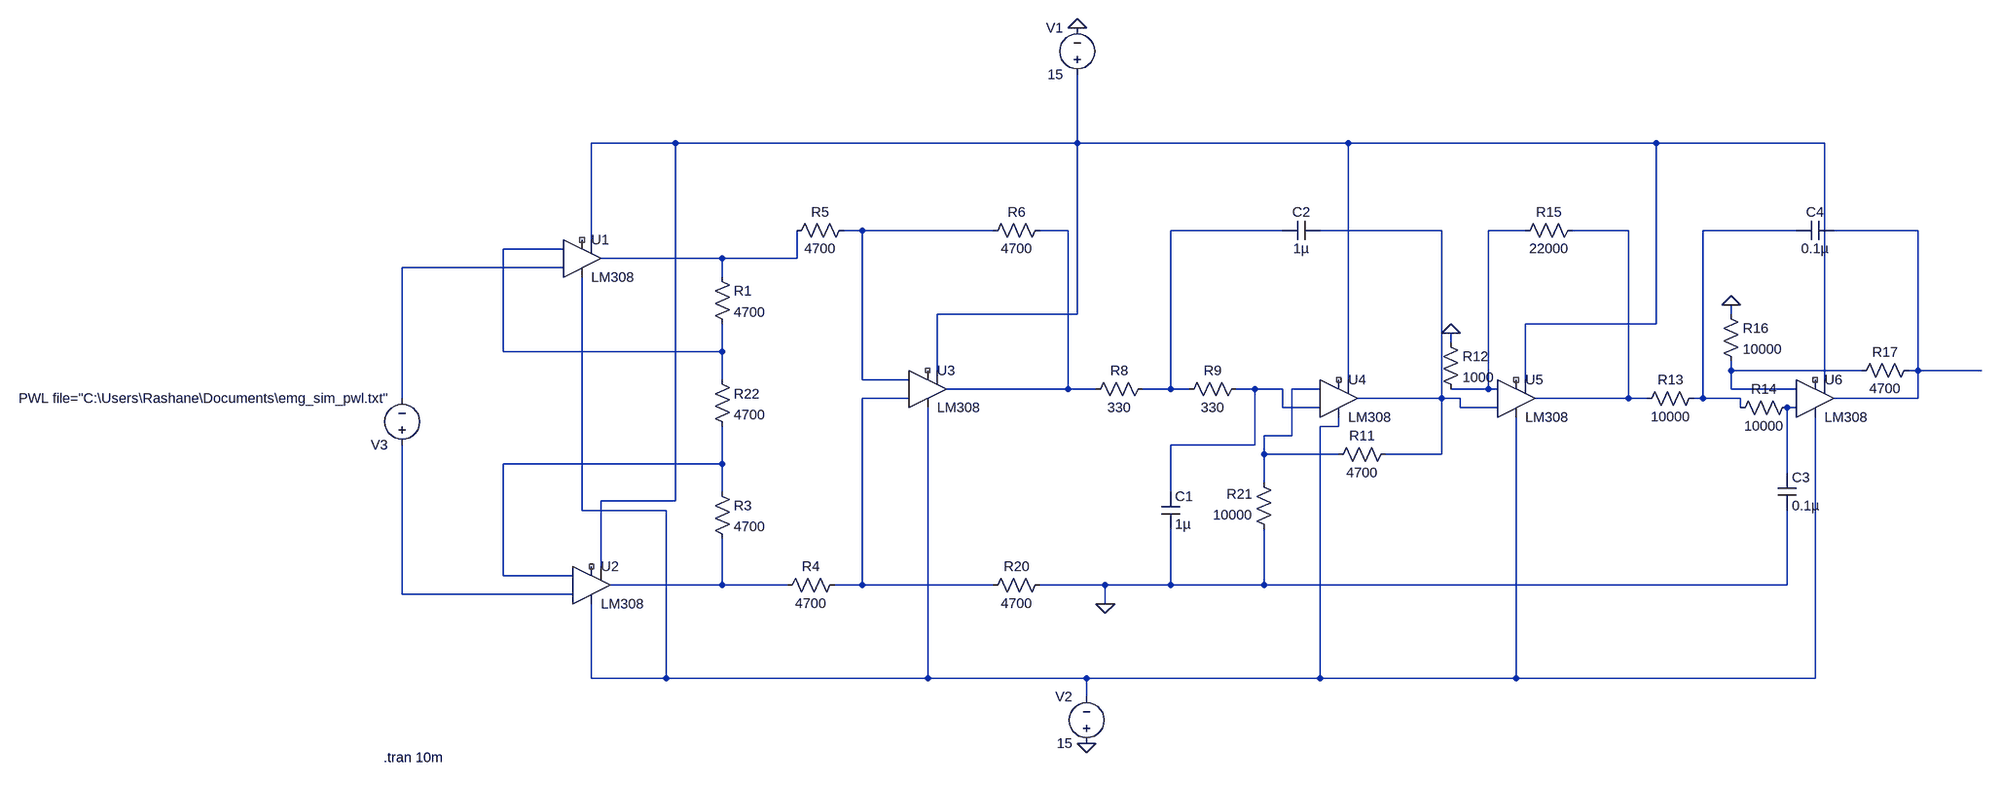
[diagram p0: schematic emg_simulate.asc]
emg_simulate.asc, the LTspice schematic file:
Version 4
SHEET 1 1876 1000
WIRE -432 -144 -576 -144
WIRE 256 -144 256 -320
WIRE 256 -144 -432 -144
WIRE 720 -144 256 -144
WIRE 1248 -144 720 -144
WIRE 1536 -144 1248 -144
WIRE -112 32 -144 32
WIRE 112 32 -112 32
WIRE 240 32 192 32
WIRE 608 32 416 32
WIRE 880 32 672 32
WIRE 1024 32 960 32
WIRE 1200 32 1104 32
WIRE 1488 32 1328 32
WIRE 1696 32 1552 32
WIRE -576 48 -576 -144
WIRE -624 64 -864 64
WIRE -352 80 -560 80
WIRE -224 80 -224 32
WIRE -224 80 -352 80
WIRE -624 96 -1072 96
WIRE -352 112 -352 80
WIRE 256 176 256 -144
WIRE 256 176 16 176
WIRE 1376 176 1376 160
WIRE 1248 192 1248 -144
WIRE 1248 192 1024 192
WIRE 896 224 896 208
WIRE -864 240 -864 64
WIRE -352 240 -352 192
WIRE -352 240 -864 240
WIRE 16 272 16 176
WIRE 1376 272 1376 256
WIRE 1600 272 1376 272
WIRE 1696 272 1696 32
WIRE 1696 272 1680 272
WIRE 1872 272 1696 272
WIRE -352 288 -352 240
WIRE -112 288 -112 32
WIRE -32 288 -112 288
WIRE 720 288 720 -144
WIRE 1024 288 1024 192
WIRE 1536 288 1536 -144
WIRE 240 304 240 32
WIRE 240 304 32 304
WIRE 288 304 240 304
WIRE 416 304 416 32
WIRE 416 304 368 304
WIRE 448 304 416 304
WIRE 560 304 528 304
WIRE 608 304 560 304
WIRE 672 304 624 304
WIRE 960 304 960 32
WIRE 960 304 896 304
WIRE 976 304 960 304
WIRE 1376 304 1376 272
WIRE 1488 304 1376 304
WIRE -1072 320 -1072 96
WIRE -32 320 -112 320
WIRE 880 320 880 32
WIRE 880 320 736 320
WIRE 912 320 880 320
WIRE 1200 320 1200 32
WIRE 1200 320 1040 320
WIRE 1232 320 1200 320
WIRE 1328 320 1328 32
WIRE 1328 320 1312 320
WIRE 1392 320 1328 320
WIRE 1696 320 1696 272
WIRE 1696 320 1552 320
WIRE 608 336 608 304
WIRE 672 336 608 336
WIRE 912 336 912 320
WIRE 976 336 912 336
WIRE 1392 336 1392 320
WIRE 1488 336 1472 336
WIRE 704 368 704 352
WIRE 704 368 672 368
WIRE 624 384 624 304
WIRE 624 384 576 384
WIRE 560 400 560 304
WIRE 560 400 416 400
WIRE 576 416 576 384
WIRE 704 416 576 416
WIRE 880 416 880 320
WIRE 880 416 784 416
WIRE -352 432 -352 368
WIRE -352 432 -864 432
WIRE 1472 448 1472 336
WIRE 576 464 576 416
WIRE -352 480 -352 432
WIRE 416 480 416 400
WIRE -432 496 -432 -144
WIRE -432 496 -560 496
WIRE -592 512 -592 112
WIRE -448 512 -592 512
WIRE -560 608 -560 496
WIRE -864 624 -864 432
WIRE -608 624 -864 624
WIRE -352 640 -352 560
WIRE -352 640 -544 640
WIRE -240 640 -352 640
WIRE -112 640 -112 320
WIRE -112 640 -160 640
WIRE 112 640 -112 640
WIRE 304 640 192 640
WIRE 416 640 416 544
WIRE 416 640 304 640
WIRE 576 640 576 544
WIRE 576 640 416 640
WIRE 1472 640 1472 512
WIRE 1472 640 576 640
WIRE -1072 656 -1072 400
WIRE -608 656 -1072 656
WIRE 304 672 304 640
WIRE -576 848 -576 672
WIRE -448 848 -448 512
WIRE -448 848 -576 848
WIRE 0 848 0 336
WIRE 0 848 -448 848
WIRE 272 848 0 848
WIRE 672 848 672 368
WIRE 672 848 272 848
WIRE 1008 848 1008 352
WIRE 1008 848 672 848
WIRE 1520 848 1520 352
WIRE 1520 848 1008 848
WIRE 272 880 272 848
FLAG 304 672 0
FLAG 896 208 0
FLAG 1376 160 0
FLAG 256 -400 0
FLAG 272 960 0
SYMBOL res -368 96 R0
SYMATTR InstName R1
SYMATTR Value 4700
SYMBOL res -368 272 R0
SYMATTR InstName R22
SYMATTR Value 4700
SYMBOL res -368 464 R0
SYMATTR InstName R3
SYMATTR Value 4700
SYMBOL res -144 624 R90
WINDOW 0 0 56 VBottom 2
WINDOW 3 32 56 VTop 2
SYMATTR InstName R4
SYMATTR Value 4700
SYMBOL res -128 16 R90
WINDOW 0 0 56 VBottom 2
WINDOW 3 32 56 VTop 2
SYMATTR InstName R5
SYMATTR Value 4700
SYMBOL res 208 16 R90
WINDOW 0 0 56 VBottom 2
WINDOW 3 32 56 VTop 2
SYMATTR InstName R6
SYMATTR Value 4700
SYMBOL res 208 624 R90
WINDOW 0 0 56 VBottom 2
WINDOW 3 32 56 VTop 2
SYMATTR InstName R20
SYMATTR Value 4700
SYMBOL res 384 288 R90
WINDOW 0 0 56 VBottom 2
WINDOW 3 32 56 VTop 2
SYMATTR InstName R8
SYMATTR Value 330
SYMBOL res 544 288 R90
WINDOW 0 0 56 VBottom 2
WINDOW 3 32 56 VTop 2
SYMATTR InstName R9
SYMATTR Value 330
SYMBOL res 592 560 R180
WINDOW 0 36 76 Left 2
WINDOW 3 36 40 Left 2
SYMATTR InstName R21
SYMATTR Value 10000
SYMBOL OpAmps\\LM308 -592 16 R0
SYMATTR InstName U1
SYMBOL OpAmps\\LM308 -576 576 R0
SYMATTR InstName U2
SYMBOL OpAmps\\LM308 0 240 R0
SYMATTR InstName U3
SYMBOL OpAmps\\LM308 704 256 R0
SYMATTR InstName U4
SYMBOL res 800 400 R90
WINDOW 0 0 56 VBottom 2
WINDOW 3 32 56 VTop 2
SYMATTR InstName R11
SYMATTR Value 4700
SYMBOL cap 400 480 R0
SYMATTR InstName C1
SYMATTR Value 1µ
SYMBOL cap 672 16 R90
WINDOW 0 0 32 VBottom 2
WINDOW 3 32 32 VTop 2
SYMATTR InstName C2
SYMATTR Value 1µ
SYMBOL OpAmps\\LM308 1008 256 R0
SYMATTR InstName U5
SYMBOL OpAmps\\LM308 1520 256 R0
SYMATTR InstName U6
SYMBOL res 880 208 R0
SYMATTR InstName R12
SYMATTR Value 1000
SYMBOL res 1328 304 R90
WINDOW 0 0 56 VBottom 2
WINDOW 3 32 56 VTop 2
SYMATTR InstName R13
SYMATTR Value 10000
SYMBOL res 1488 320 R90
WINDOW 0 0 56 VBottom 2
WINDOW 3 32 56 VTop 2
SYMATTR InstName R14
SYMATTR Value 10000
SYMBOL cap 1456 448 R0
SYMATTR InstName C3
SYMATTR Value 0.1µ
SYMBOL res 1120 16 R90
WINDOW 0 0 56 VBottom 2
WINDOW 3 32 56 VTop 2
SYMATTR InstName R15
SYMATTR Value 22000
SYMBOL res 1360 160 R0
SYMATTR InstName R16
SYMATTR Value 10000
SYMBOL res 1696 256 R90
WINDOW 0 0 56 VBottom 2
WINDOW 3 32 56 VTop 2
SYMATTR InstName R17
SYMATTR Value 4700
SYMBOL cap 1552 16 R90
WINDOW 0 0 32 VBottom 2
WINDOW 3 32 32 VTop 2
SYMATTR InstName C4
SYMATTR Value 0.1µ
SYMBOL voltage 256 -304 R180
WINDOW 0 24 96 Left 2
WINDOW 3 24 16 Left 2
WINDOW 123 0 0 Left 0
WINDOW 39 0 0 Left 0
SYMATTR InstName V1
SYMATTR Value 15
SYMBOL voltage 272 976 R180
WINDOW 0 24 96 Left 2
WINDOW 3 24 16 Left 2
WINDOW 123 0 0 Left 0
WINDOW 39 0 0 Left 0
SYMATTR InstName V2
SYMATTR Value 15
SYMBOL voltage -1072 416 R180
WINDOW 123 0 0 Left 0
WINDOW 39 0 0 Left 0
SYMATTR InstName V3
SYMATTR Value PWL file="C:\Users\Rashane\Documents\emg_sim_pwl.txt"
TEXT -1104 984 Left 2 !.tran 10m

The netlist it stands for:
* emg_simulate.asc
R1 N011 N010 4700
R22 N010 N019 4700
R3 N019 N020 4700
R4 N016 N020 4700
R5 N002 N011 4700
R6 N003 N002 4700
R20 0 N016 4700
R8 N004 N003 330
R9 N014 N004 330
R21 0 N015 10000
XU1 N012 N010 N001 N018 N011 NC_01 NC_02 LT1008
XU2 N021 N019 N001 N018 N020 NC_03 NC_04 LT1008
XU3 N016 N002 N001 N018 N003 NC_05 NC_06 LT1008
XU4 N014 N015 N001 N018 N005 NC_07 NC_08 LT1008
R11 N005 N015 4700
C1 N014 0 1µ
C2 N005 N004 1µ
XU5 N005 N006 N001 N018 N007 NC_09 NC_10 LT1008
XU6 N017 N013 N001 N018 N009 NC_11 NC_12 LT1008
R12 0 N006 1000
R13 N008 N007 10000
R14 N017 N008 10000
C3 N017 0 0.1µ
R15 N007 N006 22000
R16 0 N013 10000
R17 N009 N013 4700
C4 N009 N008 0.1µ
V1 N001 0 15
V2 0 N018 15
V3 N021 N012 PWL file="C:\Users\Rashane\Documents\emg_sim_pwl.txt"
.tran 10m
.lib LTC.lib
.backanno
.end